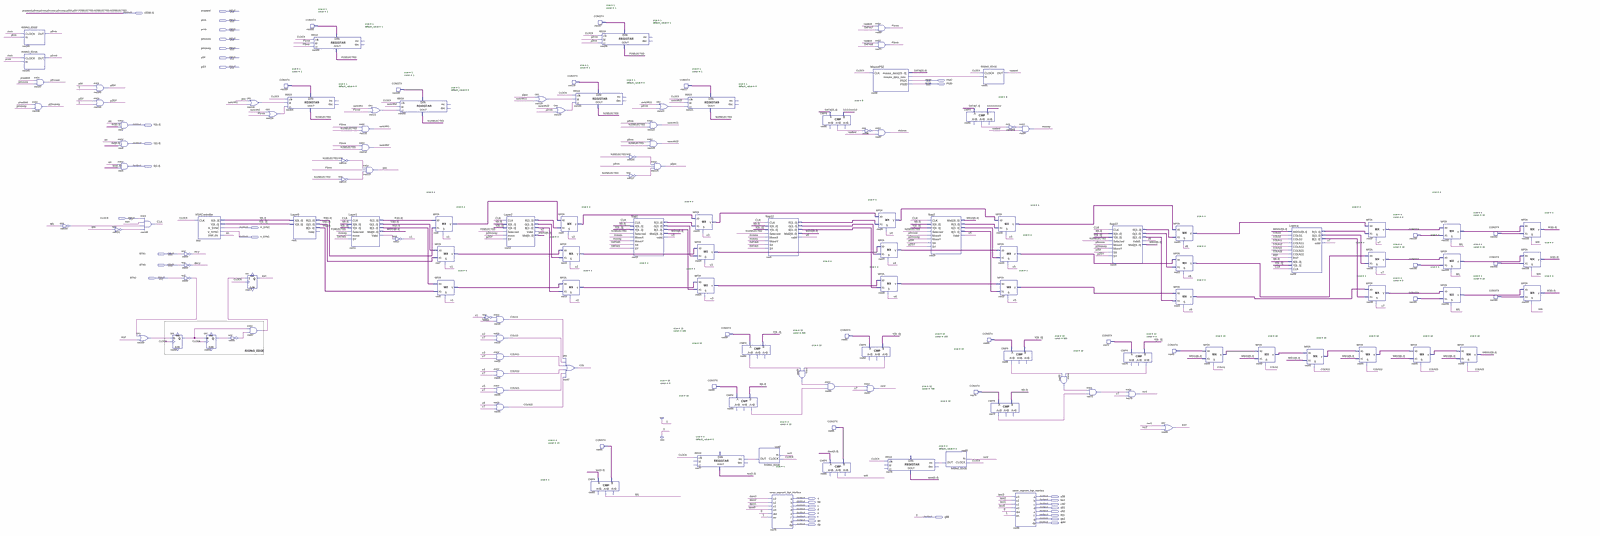
[diagram p0: schematic sheet, whole]
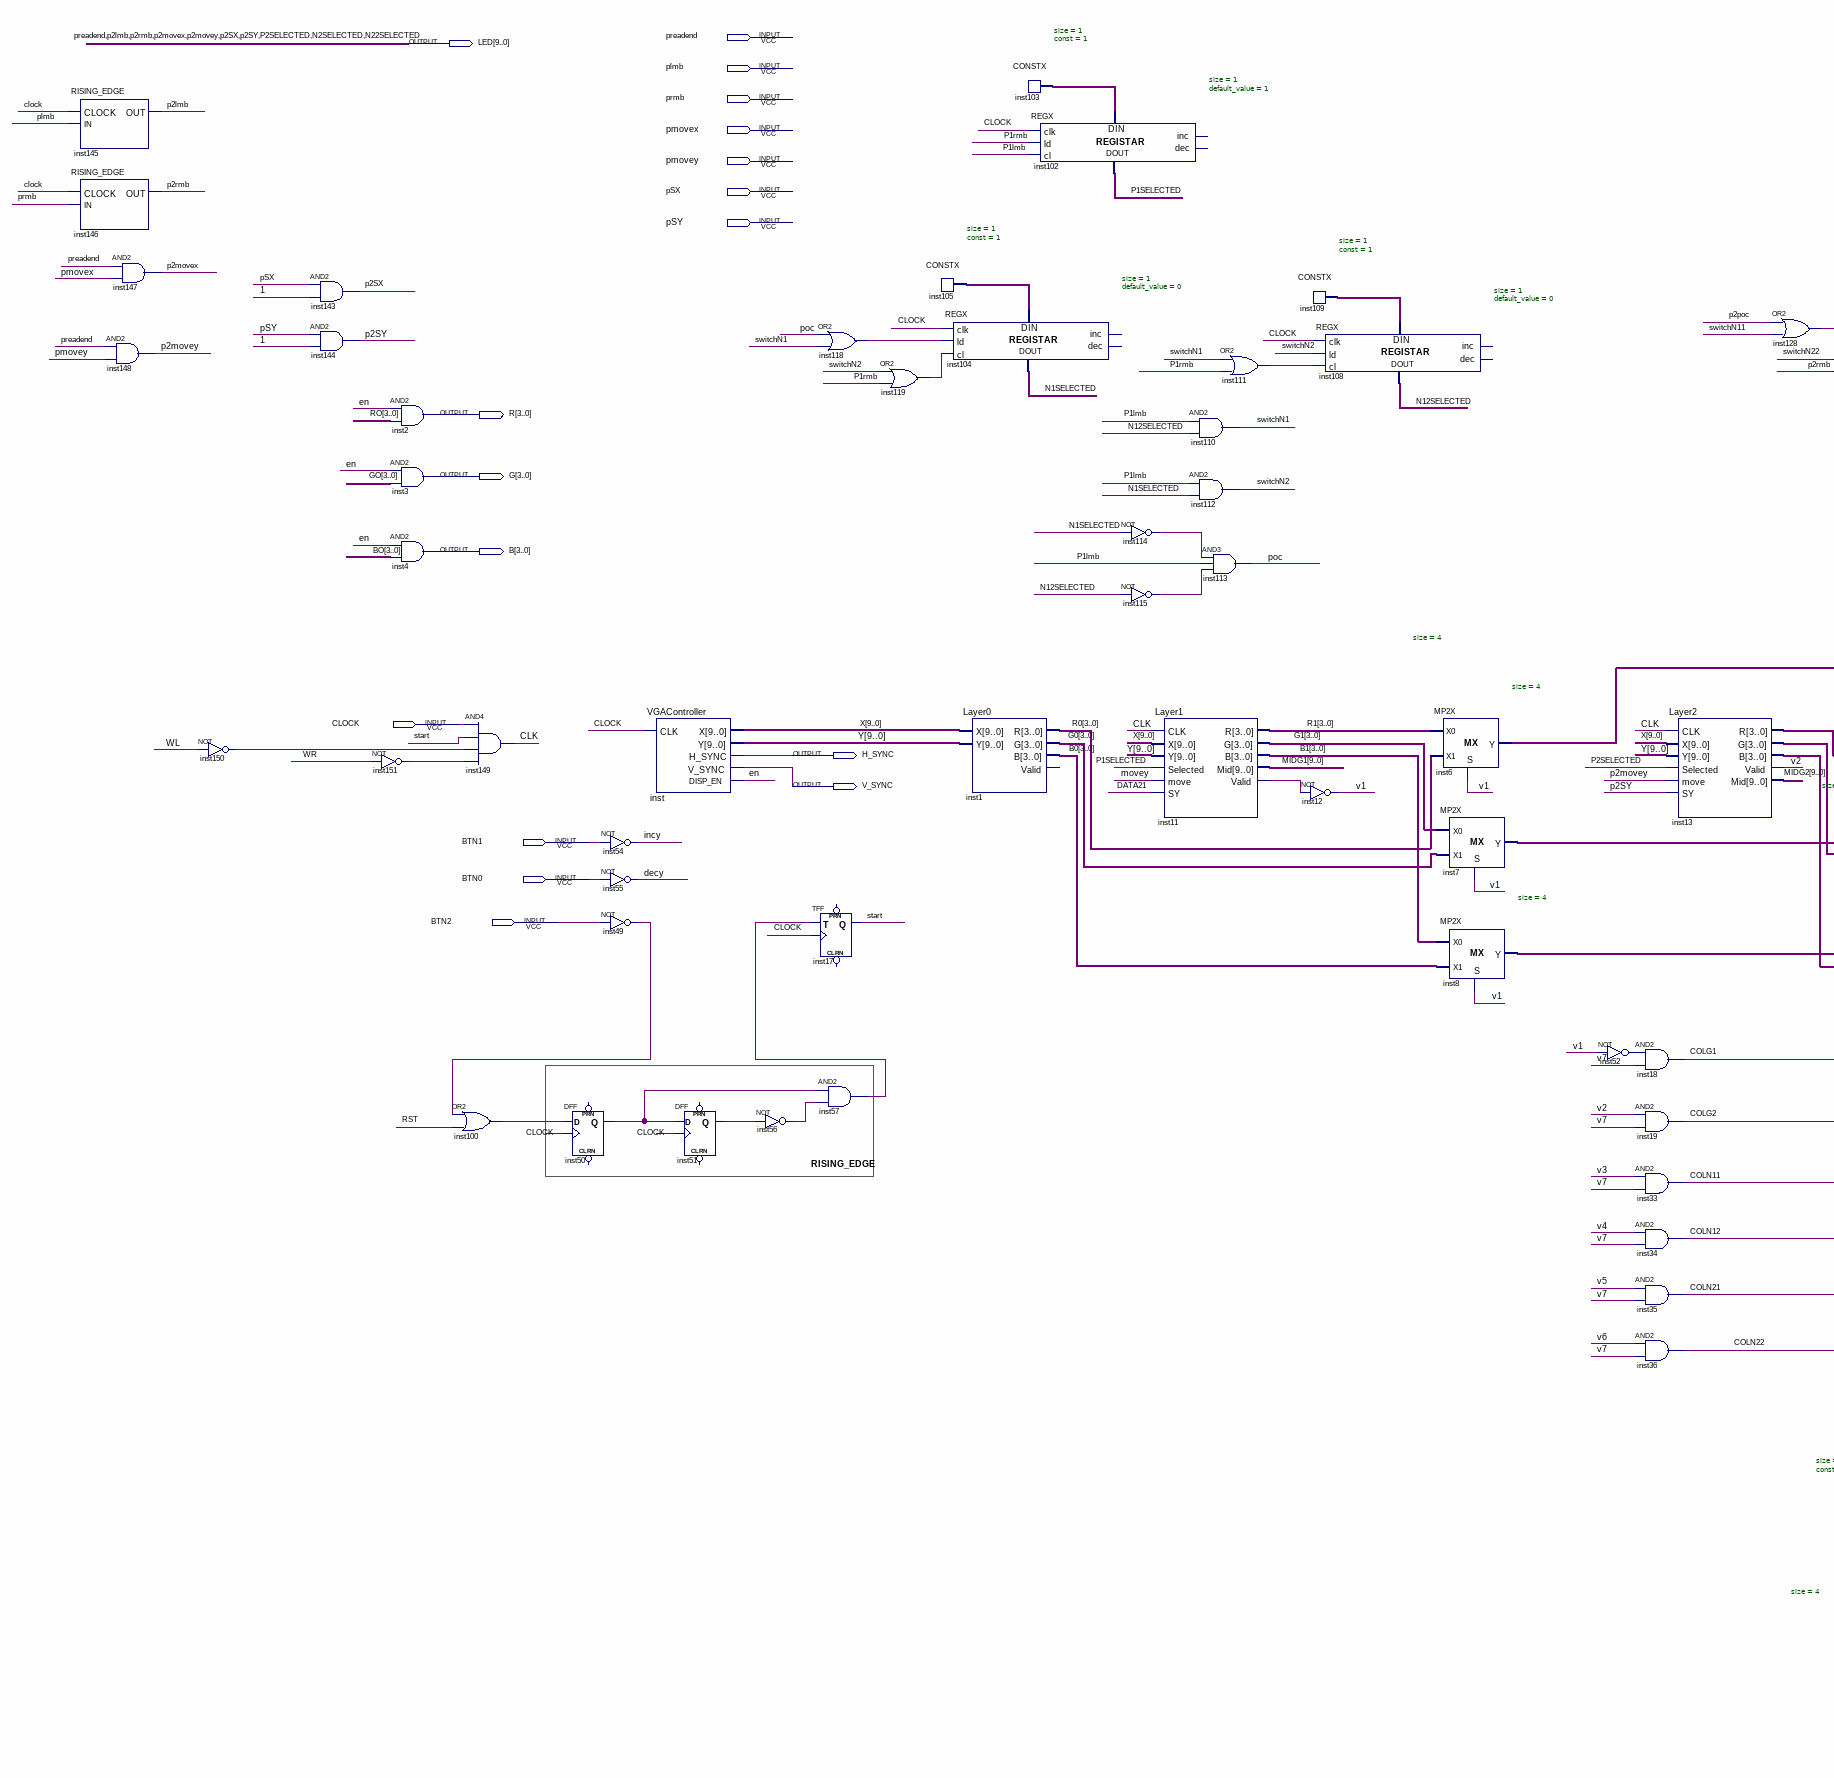
[diagram p1: schematic sheet, left part]
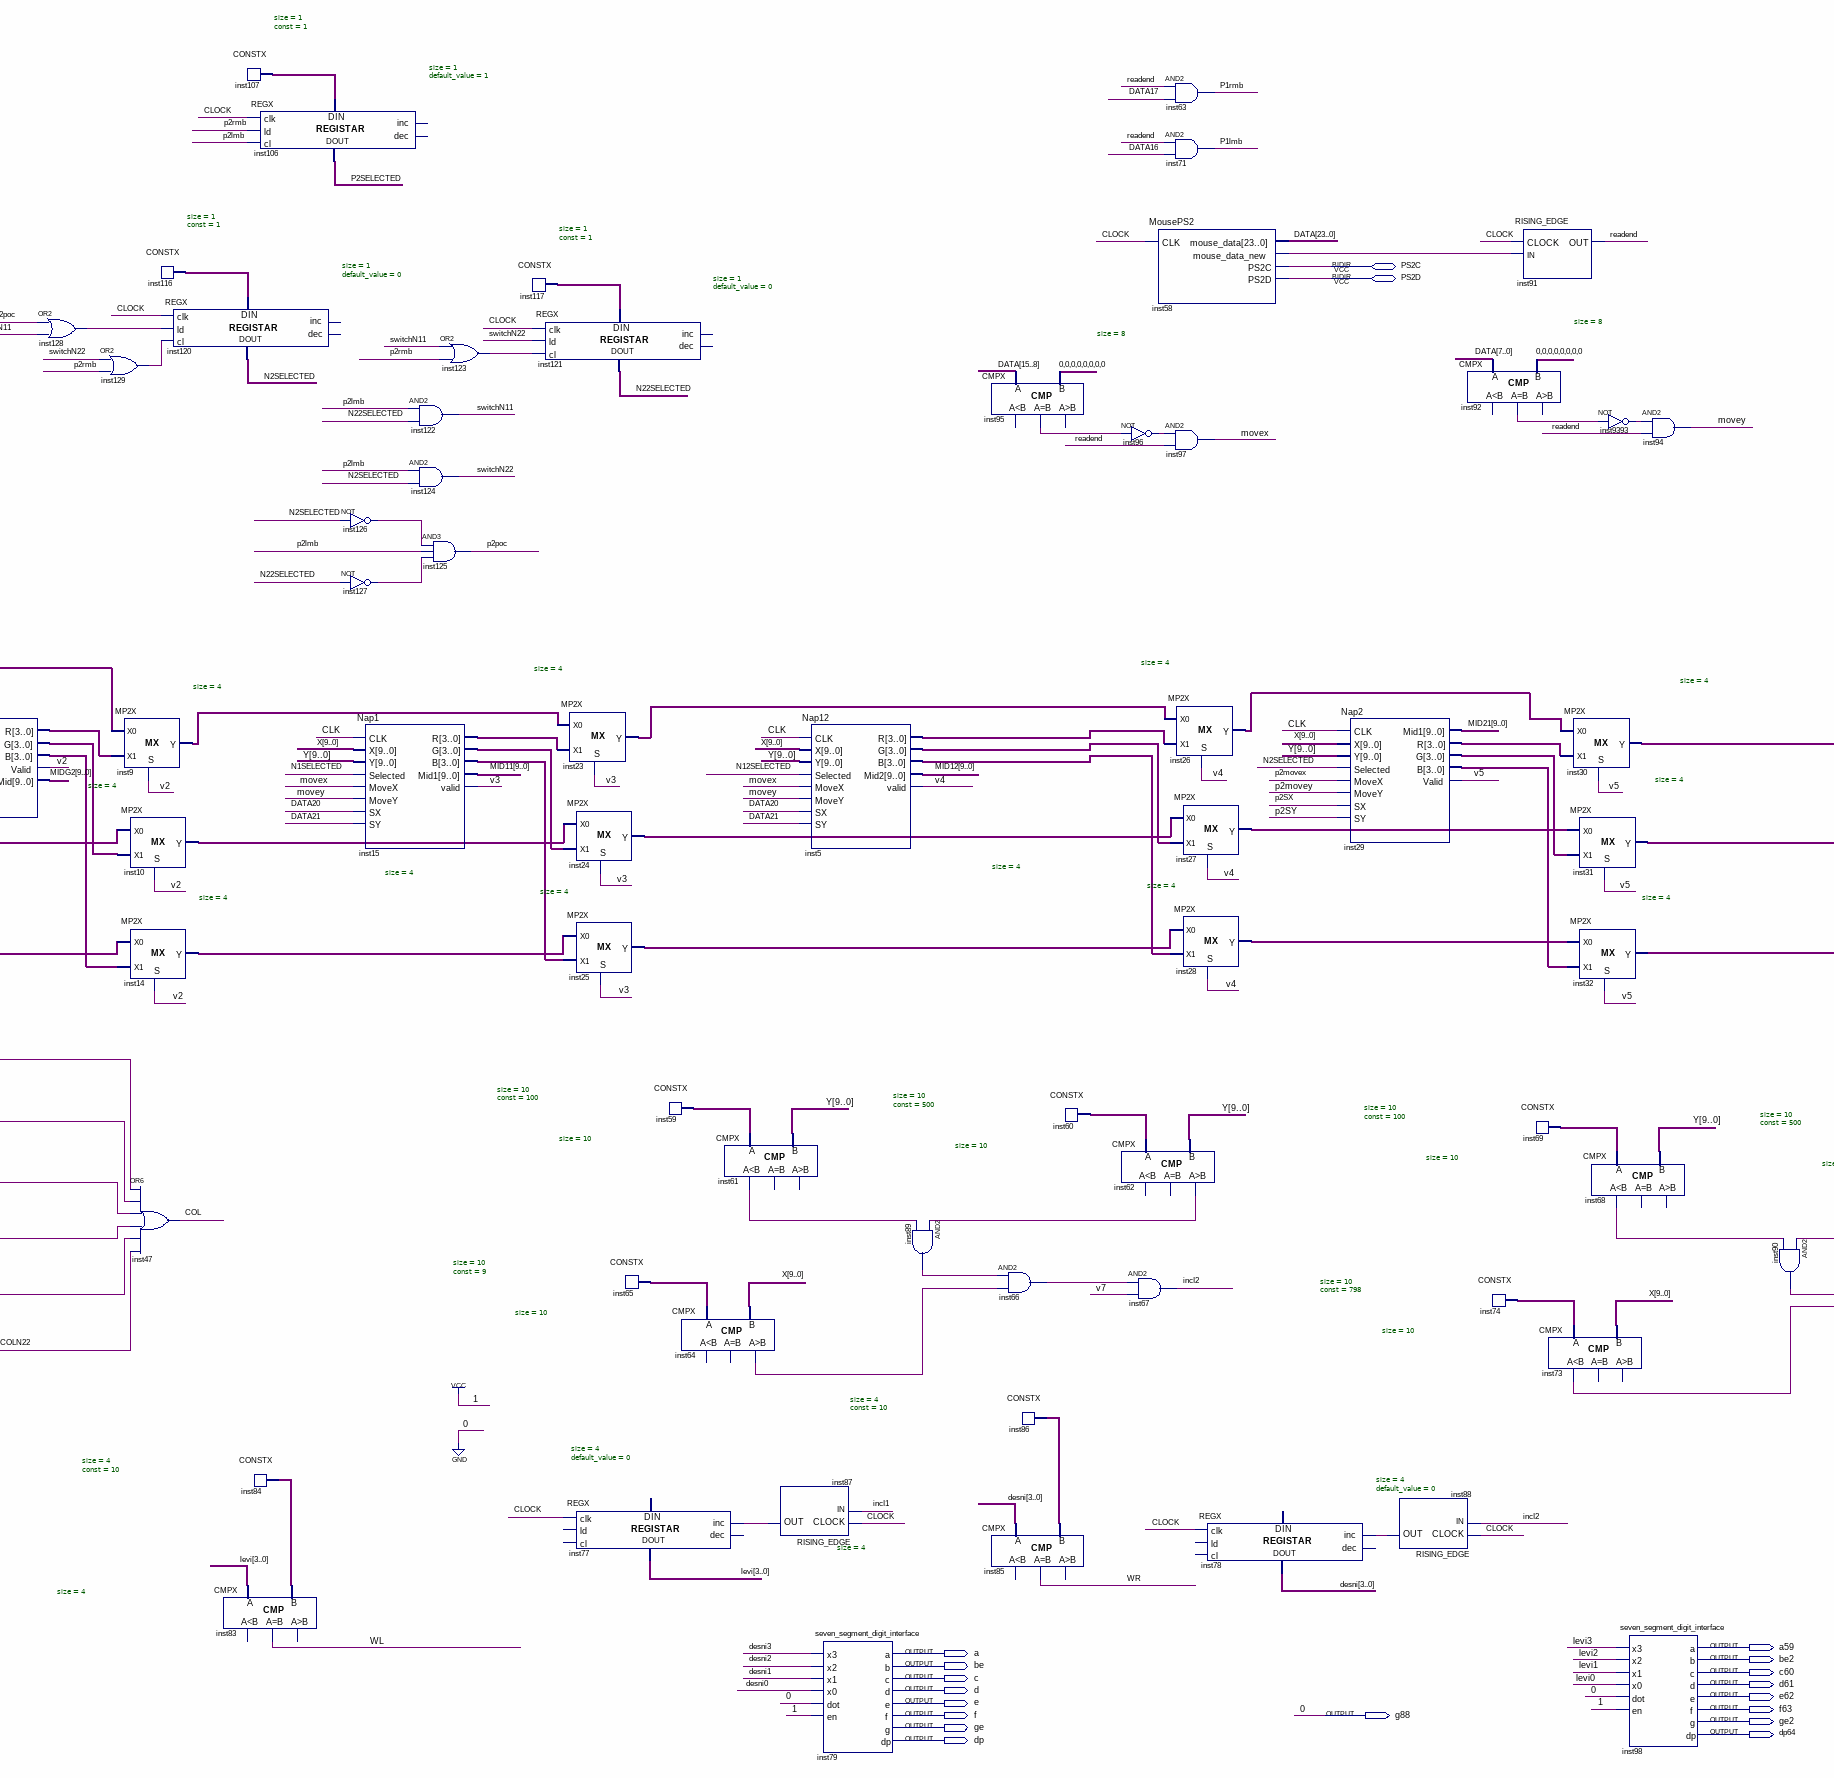
[diagram p2: schematic sheet, centre part]
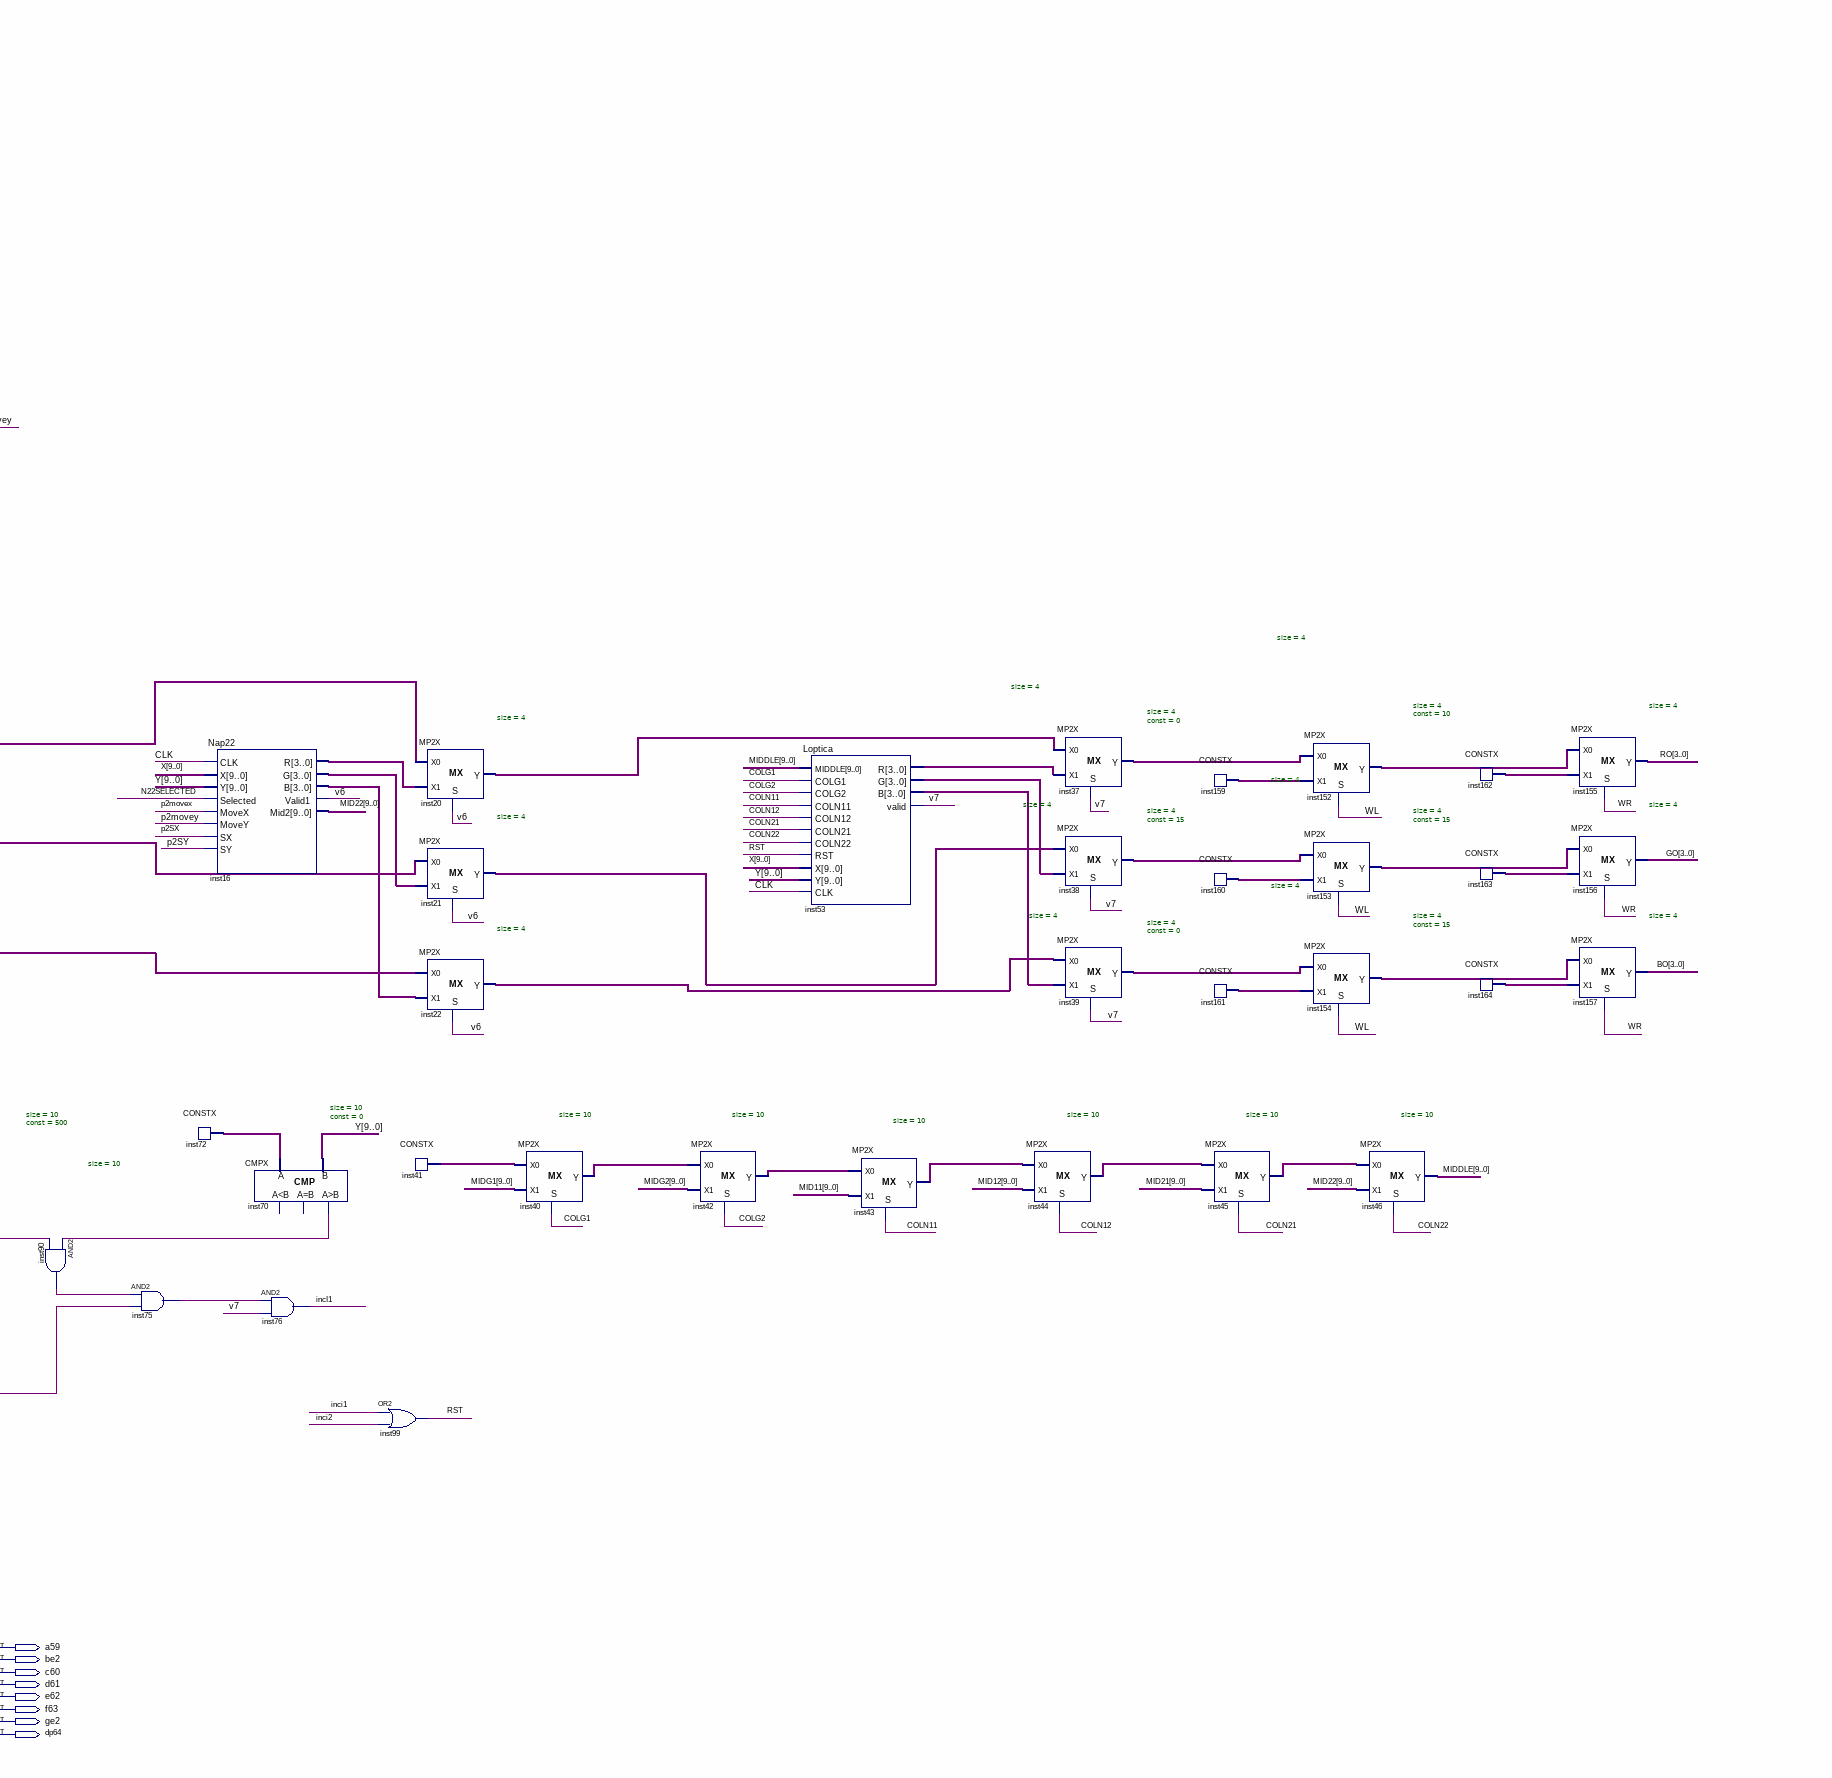
[diagram p3: schematic sheet, right part]
// Quartus schematic Main.bdf as structural Verilog: 146 symbols, 36 pins
module Main (
  input  preadend,
  input  plmb,
  input  prmb,
  input  pmovex,
  input  pmovey,
  input  pSX,
  input  pSY,
  input  CLOCK,
  input  BTN1,
  input  BTN0,
  input  BTN2,
  inout  PS2C,
  inout  PS2D,
  output [9:0] LED,
  output [3:0] R,
  output [3:0] G,
  output [3:0] B,
  output H_SYNC,
  output V_SYNC,
  output a59,
  output a,
  output be2,
  output be,
  output c60,
  output c,
  output d61,
  output d,
  output e62,
  output e,
  output f63,
  output f,
  output g88,
  output ge2,
  output ge,
  output dp64,
  output dp
);

  wire CLK, COL, COLG1, COLG2, COLN11, COLN12, COLN21, COLN22, decy, en, incI1, incI2, incy, inst11_valid,
       inst49_out, inst50_q, inst51_q, inst52_out, inst56_out, inst57_out, inst58_mouse_data_new, inst61_ls,
       inst62_gr, inst64_gr, inst66_out, inst68_ls, inst70_gr, inst73_ls, inst75_out, inst87_out, inst88_out,
       inst89_out, inst90_out, inst92_eq, inst95_eq, inst96_out, inst100_out, inst103_data, inst105_data,
       inst107_data, inst109_data, inst111_out, inst114_out, inst115_out, inst116_data, inst117_data,
       inst118_out, inst119_out, inst123_out, inst126_out, inst127_out, inst128_out, inst129_out,
       inst150_out, inst151_out, inst9393_out, movex, movey, N1SELECTED, N12SELECTED, P1lmb, P1rmb,
       P1SELECTED, p2poc, poc, readend, RST, start, switchN1, switchN2, switchN11, switchN22, v1, v2, v3, v4,
       v5, v6, v7, WL, WR;
  wire [3:0] B0, B1, BO, desni, G0, G1, GO, inst5_b, inst5_g, inst5_r, inst6_y, inst7_y, inst8_y, inst9_y,
       inst10_y, inst13_b, inst13_g, inst13_r, inst14_y, inst15_b, inst15_g, inst15_r, inst16_b, inst16_g,
       inst16_r, inst20_y, inst21_y, inst22_y, inst23_y, inst24_y, inst25_y, inst26_y, inst27_y, inst28_y,
       inst29_b, inst29_g, inst29_r, inst30_y, inst31_y, inst32_y, inst37_y, inst38_y, inst39_y, inst53_b,
       inst53_g, inst53_r, inst84_data, inst86_data, inst152_y, inst153_y, inst154_y, inst159_data,
       inst160_data, inst161_data, inst162_data, inst163_data, inst164_data, levi, R0, R1, RO;
  wire [9:0] inst40_y, inst41_data, inst42_y, inst43_y, inst44_y, inst45_y, inst59_data, inst60_data,
       inst65_data, inst69_data, inst72_data, inst74_data, MID11, MID12, MID21, MID22, MIDDLE, MIDG1, MIDG2,
       X, Y;
  wire [23:0] DATA;

  RISING_EDGE inst145 (.CLOCK(CLOCK), .IN(plmb), .OUT(LED[8]));
  RISING_EDGE inst146 (.CLOCK(CLOCK), .IN(prmb), .OUT(LED[7]));
  and inst147 (LED[6], preadend, pmovex);
  and inst148 (LED[5], preadend, pmovey);
  not inst150 (inst150_out, WL);
  and inst143 (LED[4], pSX, 1'b1);
  and inst144 (LED[3], pSY, 1'b1);
  assign R = {4{en}} & RO;  // AND2 inst2, 4 bits wide
  assign G = {4{en}} & GO;  // AND2 inst3, 4 bits wide
  assign B = {4{en}} & BO;  // AND2 inst4, 4 bits wide
  not inst151 (inst151_out, WR);
  and inst149 (CLK, CLOCK, start, inst150_out, inst151_out);
  or inst100 (inst100_out, inst49_out, RST);
  DFF inst50 (.CLK(CLOCK), .D(inst100_out), .Q(inst50_q));  // open: CLRN, PRN
  not inst54 (incy, BTN1);
  not inst55 (decy, BTN0);
  not inst49 (inst49_out, BTN2);
  VGAController inst (.CLK(CLOCK), .X(X), .Y(Y), .H_SYNC(H_SYNC), .V_SYNC(V_SYNC), .DISP_EN(en));
  DFF inst51 (.CLK(CLOCK), .D(inst50_q), .Q(inst51_q));  // open: CLRN, PRN
  not inst56 (inst56_out, inst51_q);
  or inst118 (inst118_out, poc, switchN1);
  TFF inst17 (.T(inst57_out), .CLK(CLOCK), .Q(start));  // open: PRN, CLRN
  and inst57 (inst57_out, inst50_q, inst56_out);
  or inst119 (inst119_out, switchN2, P1rmb);
  CONSTX #(.size(1), .\const (1)) inst105 (.data(inst105_data));
  REGX #(.size(1), .default_value(0)) inst104 (
    .clk(CLOCK), .ld(inst118_out), .cl(inst119_out), .data_in(inst105_data), .data_out(N1SELECTED));  // open: inc, dec
  Layer0 inst1 (.X(X), .Y(Y), .R(R0), .G(G0), .B(B0));  // open: Valid
  CONSTX #(.size(1), .\const (1)) inst103 (.data(inst103_data));
  REGX #(.size(1), .default_value(1)) inst102 (
    .clk(CLOCK), .ld(P1rmb), .cl(P1lmb), .data_in(inst103_data), .data_out(P1SELECTED));  // open: inc, dec
  not inst114 (inst114_out, N1SELECTED);
  not inst115 (inst115_out, N12SELECTED);
  Layer1 inst11 (
    .CLK(CLK), .X(X), .Y(Y), .Selected(P1SELECTED), .move(movey), .SY(DATA[21]), .R(R1), .G(G1), .B(B1),
    .Mid(MIDG1), .Valid(inst11_valid));
  or inst111 (inst111_out, switchN1, P1rmb);
  and inst110 (switchN1, P1lmb, N12SELECTED);
  and inst112 (switchN2, P1lmb, N1SELECTED);
  and inst113 (poc, inst114_out, P1lmb, inst115_out);
  CONSTX #(.size(1), .\const (1)) inst109 (.data(inst109_data));
  REGX #(.size(1), .default_value(0)) inst108 (
    .clk(CLOCK), .ld(switchN2), .cl(inst111_out), .data_in(inst109_data), .data_out(N12SELECTED));  // open: inc, dec
  not inst12 (v1, inst11_valid);
  MP2X #(.size(4)) inst6 (.S(v1), .X0(R1), .X1(R0), .Y(inst6_y));
  MP2X #(.size(4)) inst7 (.S(v1), .X0(G1), .X1(G0), .Y(inst7_y));
  MP2X #(.size(4)) inst8 (.S(v1), .X0(B1), .X1(B0), .Y(inst8_y));
  not inst52 (inst52_out, v1);
  Layer2 inst13 (
    .CLK(CLK), .X(X), .Y(Y), .Selected(LED[2]), .move(LED[5]), .SY(LED[3]), .R(inst13_r), .G(inst13_g),
    .B(inst13_b), .Valid(v2), .Mid(MIDG2));
  and inst18 (COLG1, inst52_out, v7);
  and inst19 (COLG2, v2, v7);
  and inst33 (COLN11, v3, v7);
  and inst34 (COLN12, v4, v7);
  and inst35 (COLN21, v5, v7);
  and inst36 (COLN22, v6, v7);
  or inst128 (inst128_out, p2poc, switchN11);
  CONSTX #(.size(1), .\const (1)) inst116 (.data(inst116_data));
  or inst129 (inst129_out, switchN22, LED[7]);
  MP2X #(.size(4)) inst9 (.S(v2), .X0(inst6_y), .X1(inst13_r), .Y(inst9_y));
  MP2X #(.size(4)) inst10 (.S(v2), .X0(inst7_y), .X1(inst13_g), .Y(inst10_y));
  MP2X #(.size(4)) inst14 (.S(v2), .X0(inst8_y), .X1(inst13_b), .Y(inst14_y));
  or inst47 (COL, COLG1, COLG2, COLN11, COLN12, COLN21, COLN22);
  REGX #(.size(1), .default_value(0)) inst120 (
    .clk(CLOCK), .ld(inst128_out), .cl(inst129_out), .data_in(inst116_data), .data_out(LED[1]));  // open: inc, dec
  CONSTX #(.size(1), .\const (1)) inst107 (.data(inst107_data));
  CONSTX #(.size(4), .\const (10)) inst84 (.data(inst84_data));
  CMPX #(.size(4)) inst83 (.A(levi), .B(inst84_data), .eq(WL));  // open: ls, gr
  REGX #(.size(1), .default_value(1)) inst106 (
    .clk(CLOCK), .ld(LED[7]), .cl(LED[8]), .data_in(inst107_data), .data_out(LED[2]));  // open: inc, dec
  not inst126 (inst126_out, LED[1]);
  not inst127 (inst127_out, LED[0]);
  Nap1 inst15 (
    .CLK(CLK), .X(X), .Y(Y), .Selected(N1SELECTED), .MoveX(movex), .MoveY(movey), .SX(DATA[20]),
    .SY(DATA[21]), .R(inst15_r), .G(inst15_g), .B(inst15_b), .Mid1(MID11), .valid(v3));
  or inst123 (inst123_out, switchN11, LED[7]);
  and inst122 (switchN11, LED[8], LED[0]);
  and inst124 (switchN22, LED[8], LED[1]);
  and inst125 (p2poc, inst126_out, LED[8], inst127_out);
  CONSTX #(.size(1), .\const (1)) inst117 (.data(inst117_data));
  REGX #(.size(1), .default_value(0)) inst121 (
    .clk(CLOCK), .ld(switchN22), .cl(inst123_out), .data_in(inst117_data), .data_out(LED[0]));  // open: inc, dec
  MP2X #(.size(4)) inst23 (.S(v3), .X0(inst9_y), .X1(inst15_r), .Y(inst23_y));
  MP2X #(.size(4)) inst24 (.S(v3), .X0(inst10_y), .X1(inst15_g), .Y(inst24_y));
  MP2X #(.size(4)) inst25 (.S(v3), .X0(inst14_y), .X1(inst15_b), .Y(inst25_y));
  REGX #(.size(4), .default_value(0)) inst77 (
    .clk(CLOCK), .inc(inst87_out), .data_out(levi));  // open: ld, cl, dec, data_in
  CONSTX #(.size(10), .\const (9)) inst65 (.data(inst65_data));
  CONSTX #(.size(10), .\const (100)) inst59 (.data(inst59_data));
  CMPX #(.size(10)) inst64 (.A(inst65_data), .B(X), .gr(inst64_gr));  // open: ls, eq
  CMPX #(.size(10)) inst61 (.A(inst59_data), .B(Y), .ls(inst61_ls));  // open: eq, gr
  RISING_EDGE inst87 (.CLOCK(CLOCK), .IN(incI1), .OUT(inst87_out));
  Nap12 inst5 (
    .CLK(CLK), .X(X), .Y(Y), .Selected(N12SELECTED), .MoveX(movex), .MoveY(movey), .SX(DATA[20]),
    .SY(DATA[21]), .R(inst5_r), .G(inst5_g), .B(inst5_b), .Mid2(MID12), .valid(v4));
  seven_segment_digit_interface inst79 (
    .x3(desni[3]), .x2(desni[2]), .x1(desni[1]), .x0(desni[0]), .dot(1'b0), .en(1'b1), .a(a), .b(be), .c(c),
    .d(d), .e(e), .f(f), .g(ge), .dp(dp));
  and inst89 (inst89_out, inst62_gr, inst61_ls);
  CMPX #(.size(8)) inst95 (.A(DATA[15:8]), .B({8{1'b0}}), .eq(inst95_eq));  // open: ls, gr
  CMPX #(.size(4)) inst85 (.A(desni), .B(inst86_data), .eq(WR));  // open: ls, gr
  and inst66 (inst66_out, inst89_out, inst64_gr);
  CONSTX #(.size(4), .\const (10)) inst86 (.data(inst86_data));
  CONSTX #(.size(10), .\const (500)) inst60 (.data(inst60_data));
  not inst96 (inst96_out, inst95_eq);
  CMPX #(.size(10)) inst62 (.A(inst60_data), .B(Y), .gr(inst62_gr));  // open: ls, eq
  and inst67 (incI2, inst66_out, v7);
  and inst63 (P1rmb, readend, DATA[17]);
  and inst71 (P1lmb, readend, DATA[16]);
  MousePS2 inst58 (.CLK(CLOCK), .mouse_data(DATA), .mouse_data_new(inst58_mouse_data_new), .PS2C(PS2C), .PS2D(PS2D));
  and inst97 (movex, inst96_out, readend);
  MP2X #(.size(4)) inst26 (.S(v4), .X0(inst23_y), .X1(inst5_r), .Y(inst26_y));
  MP2X #(.size(4)) inst27 (.S(v4), .X0(inst24_y), .X1(inst5_g), .Y(inst27_y));
  MP2X #(.size(4)) inst28 (.S(v4), .X0(inst25_y), .X1(inst5_b), .Y(inst28_y));
  REGX #(.size(4), .default_value(0)) inst78 (
    .clk(CLOCK), .inc(inst88_out), .data_out(desni));  // open: ld, cl, dec, data_in
  Nap2 inst29 (
    .CLK(CLK), .X(X), .Y(Y), .Selected(LED[1]), .MoveX(LED[6]), .MoveY(LED[5]), .SX(LED[4]), .SY(LED[3]),
    .Mid1(MID21), .R(inst29_r), .G(inst29_g), .B(inst29_b), .Valid(v5));
  RISING_EDGE inst88 (.CLOCK(CLOCK), .IN(incI2), .OUT(inst88_out));
  CMPX #(.size(8)) inst92 (.A(DATA[7:0]), .B({8{1'b0}}), .eq(inst92_eq));  // open: ls, gr
  CONSTX #(.size(10), .\const (798)) inst74 (.data(inst74_data));
  RISING_EDGE inst91 (.CLOCK(CLOCK), .IN(inst58_mouse_data_new), .OUT(readend));
  CONSTX #(.size(10), .\const (100)) inst69 (.data(inst69_data));
  MP2X #(.size(4)) inst30 (.S(v5), .X0(inst26_y), .X1(inst29_r), .Y(inst30_y));
  MP2X #(.size(4)) inst31 (.S(v5), .X0(inst27_y), .X1(inst29_g), .Y(inst31_y));
  MP2X #(.size(4)) inst32 (.S(v5), .X0(inst28_y), .X1(inst29_b), .Y(inst32_y));
  CMPX #(.size(10)) inst68 (.A(inst69_data), .B(Y), .ls(inst68_ls));  // open: eq, gr
  CMPX #(.size(10)) inst73 (.A(inst74_data), .B(X), .ls(inst73_ls));  // open: eq, gr
  not inst9393 (inst9393_out, inst92_eq);
  seven_segment_digit_interface inst98 (
    .x3(levi[3]), .x2(levi[2]), .x1(levi[1]), .x0(levi[0]), .dot(1'b0), .en(1'b1), .a(a59), .b(be2), .c(c60),
    .d(d61), .e(e62), .f(f63), .g(ge2), .dp(dp64));
  and inst94 (movey, inst9393_out, readend);
  and inst90 (inst90_out, inst70_gr, inst68_ls);
  and inst75 (inst75_out, inst90_out, inst73_ls);
  CONSTX #(.size(10), .\const (500)) inst72 (.data(inst72_data));
  Nap22 inst16 (
    .CLK(CLK), .X(X), .Y(Y), .Selected(LED[0]), .MoveX(LED[6]), .MoveY(LED[5]), .SX(LED[4]), .SY(LED[3]),
    .R(inst16_r), .G(inst16_g), .B(inst16_b), .Valid1(v6), .Mid2(MID22));
  CMPX #(.size(10)) inst70 (.A(inst72_data), .B(Y), .gr(inst70_gr));  // open: ls, eq
  and inst76 (incI1, inst75_out, v7);
  or inst99 (RST, incI1, incI2);
  MP2X #(.size(4)) inst20 (.S(v6), .X0(inst30_y), .X1(inst16_r), .Y(inst20_y));
  MP2X #(.size(4)) inst21 (.S(v6), .X0(inst31_y), .X1(inst16_g), .Y(inst21_y));
  MP2X #(.size(4)) inst22 (.S(v6), .X0(inst32_y), .X1(inst16_b), .Y(inst22_y));
  CONSTX #(.size(10), .\const (0)) inst41 (.data(inst41_data));
  MP2X #(.size(10)) inst40 (.S(COLG1), .X0(inst41_data), .X1(MIDG1), .Y(inst40_y));
  MP2X #(.size(10)) inst42 (.S(COLG2), .X0(inst40_y), .X1(MIDG2), .Y(inst42_y));
  Loptica inst53 (
    .MIDDLE(MIDDLE), .COLG1(COLG1), .COLG2(COLG2), .COLN11(COLN11), .COLN12(COLN12), .COLN21(COLN21),
    .COLN22(COLN22), .RST(RST), .X(X), .Y(Y), .CLK(CLK), .R(inst53_r), .G(inst53_g), .B(inst53_b), .valid(v7));
  MP2X #(.size(10)) inst43 (.S(COLN11), .X0(inst42_y), .X1(MID11), .Y(inst43_y));
  MP2X #(.size(10)) inst44 (.S(COLN12), .X0(inst43_y), .X1(MID12), .Y(inst44_y));
  MP2X #(.size(4)) inst37 (.S(v7), .X0(inst20_y), .X1(inst53_r), .Y(inst37_y));
  MP2X #(.size(4)) inst38 (.S(v7), .X0(inst21_y), .X1(inst53_g), .Y(inst38_y));
  MP2X #(.size(4)) inst39 (.S(v7), .X0(inst22_y), .X1(inst53_b), .Y(inst39_y));
  CONSTX #(.size(4), .\const (0)) inst159 (.data(inst159_data));
  CONSTX #(.size(4), .\const (15)) inst160 (.data(inst160_data));
  CONSTX #(.size(4), .\const (0)) inst161 (.data(inst161_data));
  MP2X #(.size(10)) inst45 (.S(COLN21), .X0(inst44_y), .X1(MID21), .Y(inst45_y));
  MP2X #(.size(4)) inst152 (.S(WL), .X0(inst37_y), .X1(inst159_data), .Y(inst152_y));
  MP2X #(.size(4)) inst153 (.S(WL), .X0(inst38_y), .X1(inst160_data), .Y(inst153_y));
  MP2X #(.size(4)) inst154 (.S(WL), .X0(inst39_y), .X1(inst161_data), .Y(inst154_y));
  MP2X #(.size(10)) inst46 (.S(COLN22), .X0(inst45_y), .X1(MID22), .Y(MIDDLE));
  CONSTX #(.size(4), .\const (10)) inst162 (.data(inst162_data));
  CONSTX #(.size(4), .\const (15)) inst163 (.data(inst163_data));
  CONSTX #(.size(4), .\const (15)) inst164 (.data(inst164_data));
  MP2X #(.size(4)) inst155 (.S(WR), .X0(inst152_y), .X1(inst162_data), .Y(RO));
  MP2X #(.size(4)) inst156 (.S(WR), .X0(inst153_y), .X1(inst163_data), .Y(GO));
  MP2X #(.size(4)) inst157 (.S(WR), .X0(inst154_y), .X1(inst164_data), .Y(BO));

  assign g88 = 1'b0;
  assign LED[9] = preadend;

  // Other names for the same wires on the sheet: N2SELECTED = LED[1]; N22SELECTED = LED[0]; p2lmb = LED[8];
  //   p2movex = LED[6]; p2movey = LED[5]; p2rmb = LED[7]; P2SELECTED = LED[2]; p2SX = LED[4]; p2SY = LED[3]

  // Notes on the sheet:
  //   RISING_EDGE
endmodule
